# Altium schematic sheet HU_revB.SchDoc
size D; SheetNumber: 1; SheetTotal: 17
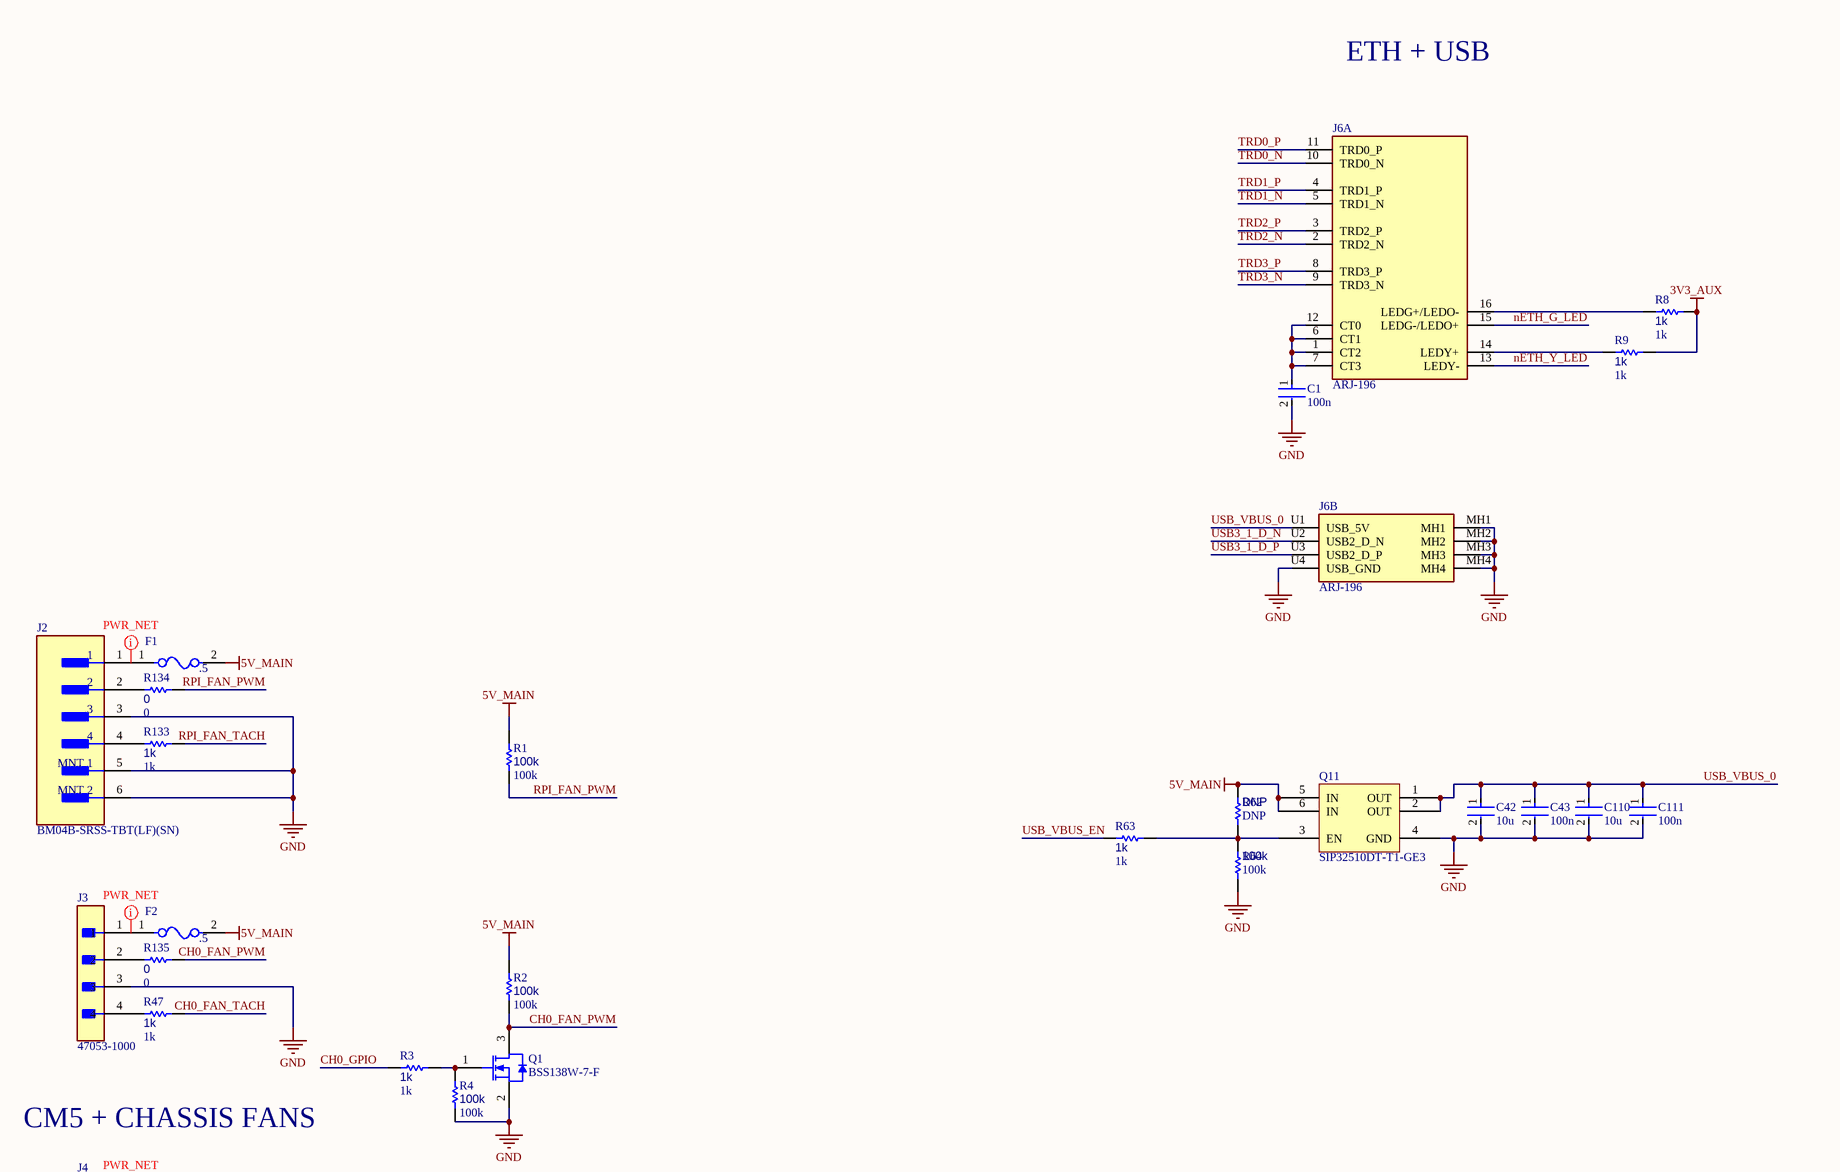
[diagram p0: HU_revB.SchDoc, top right]
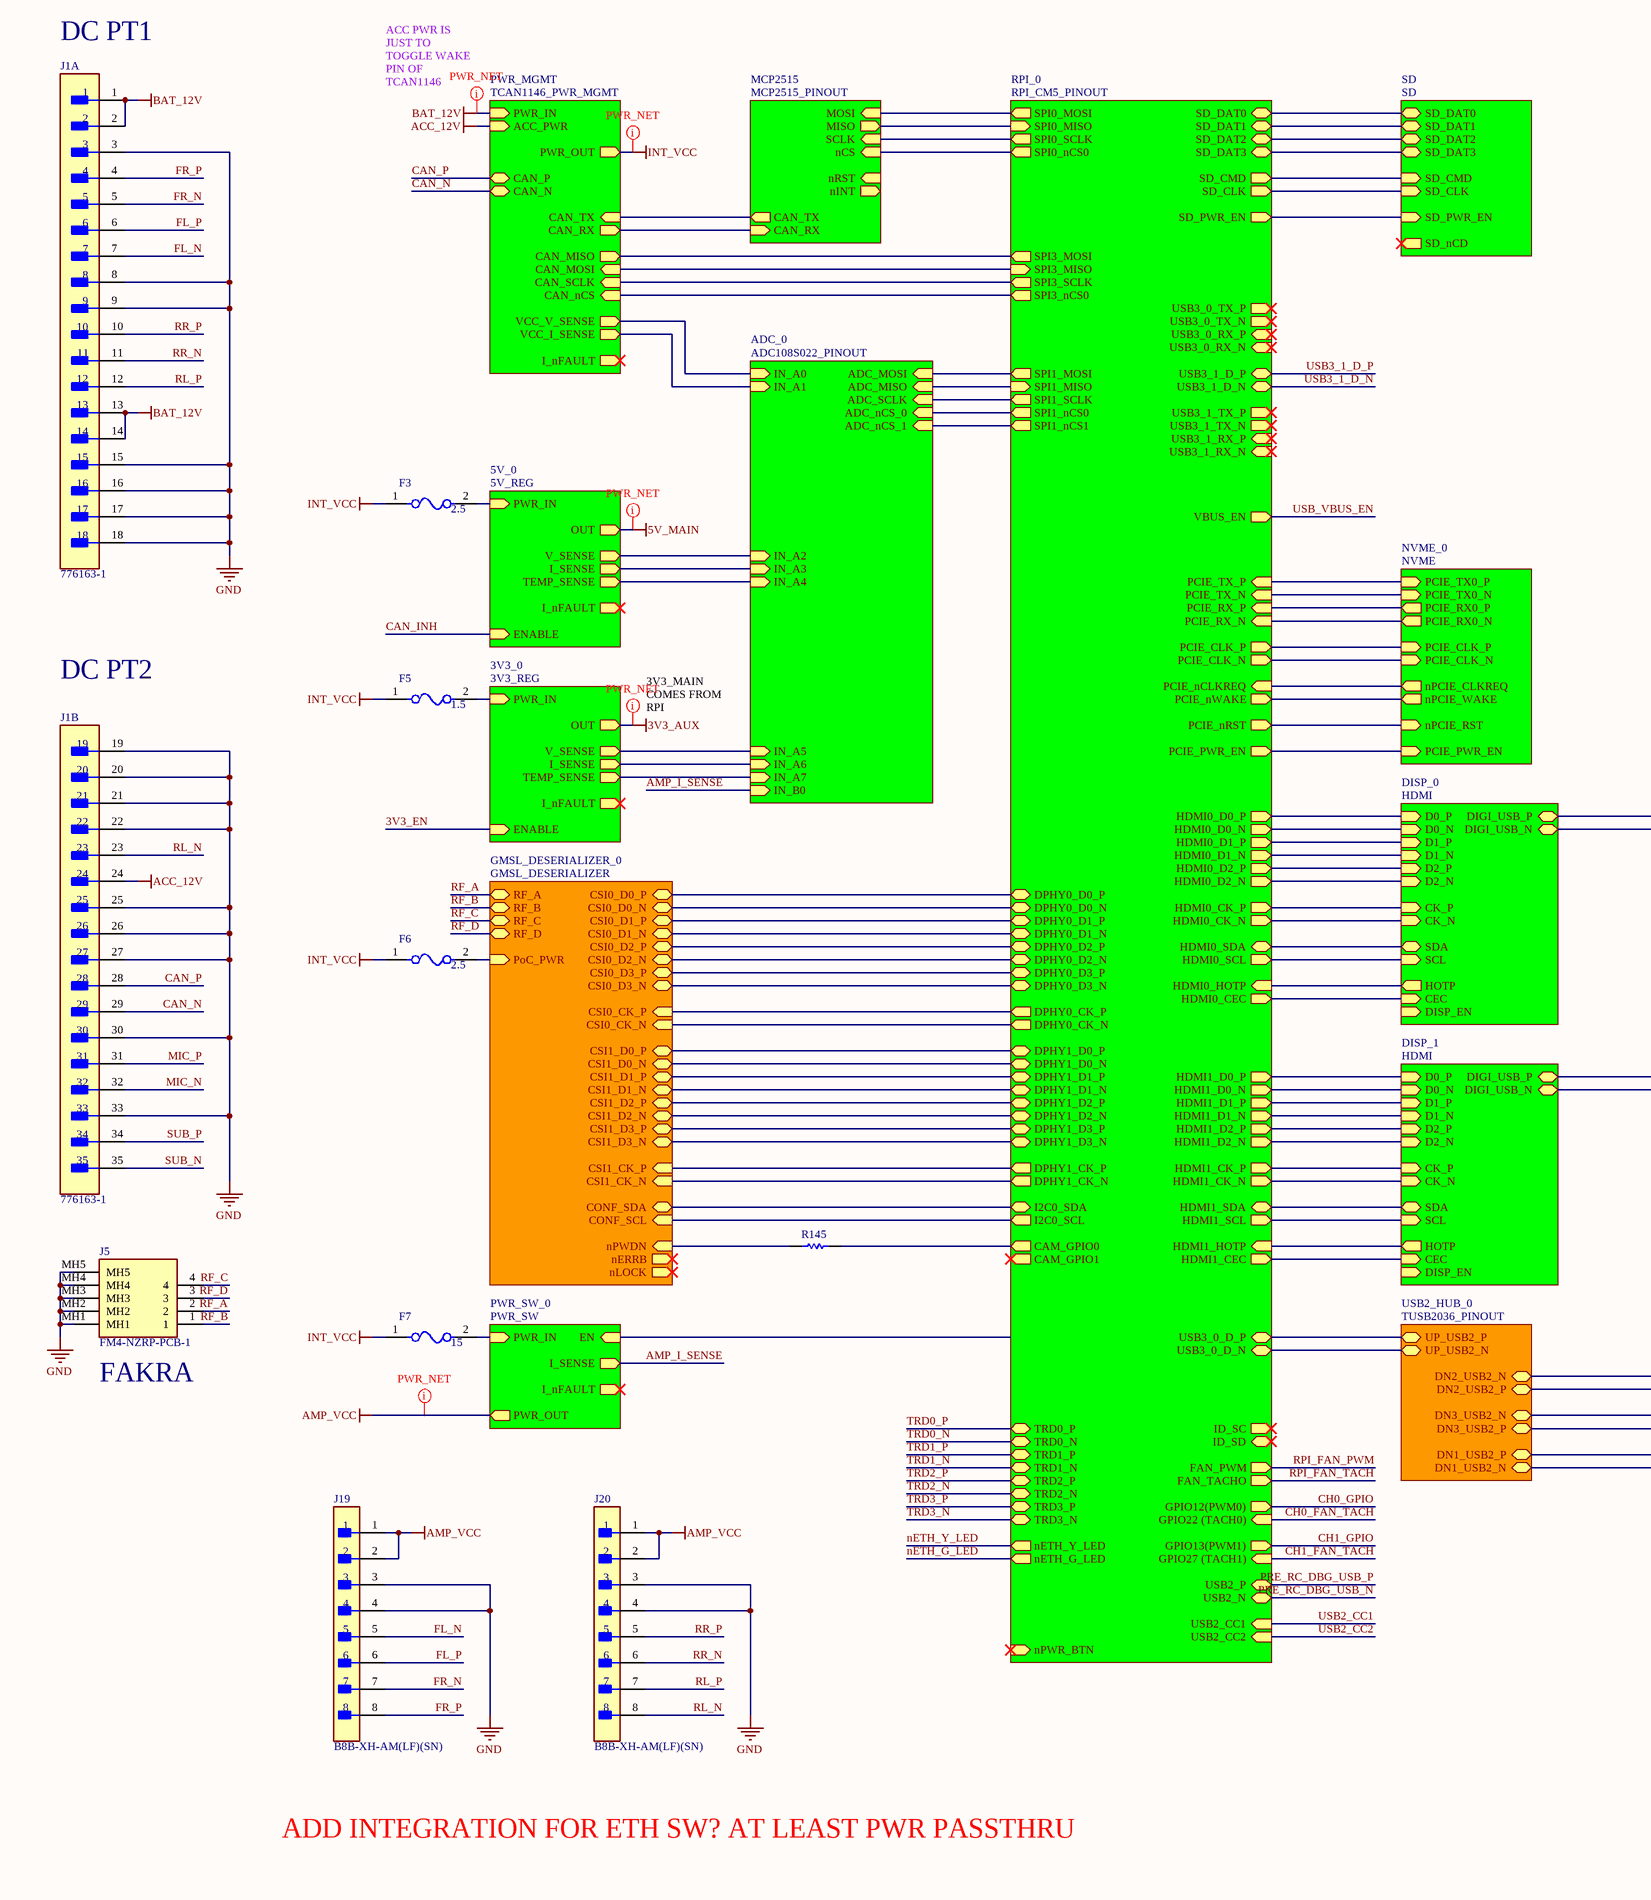
[diagram p1: HU_revB.SchDoc, bottom left]
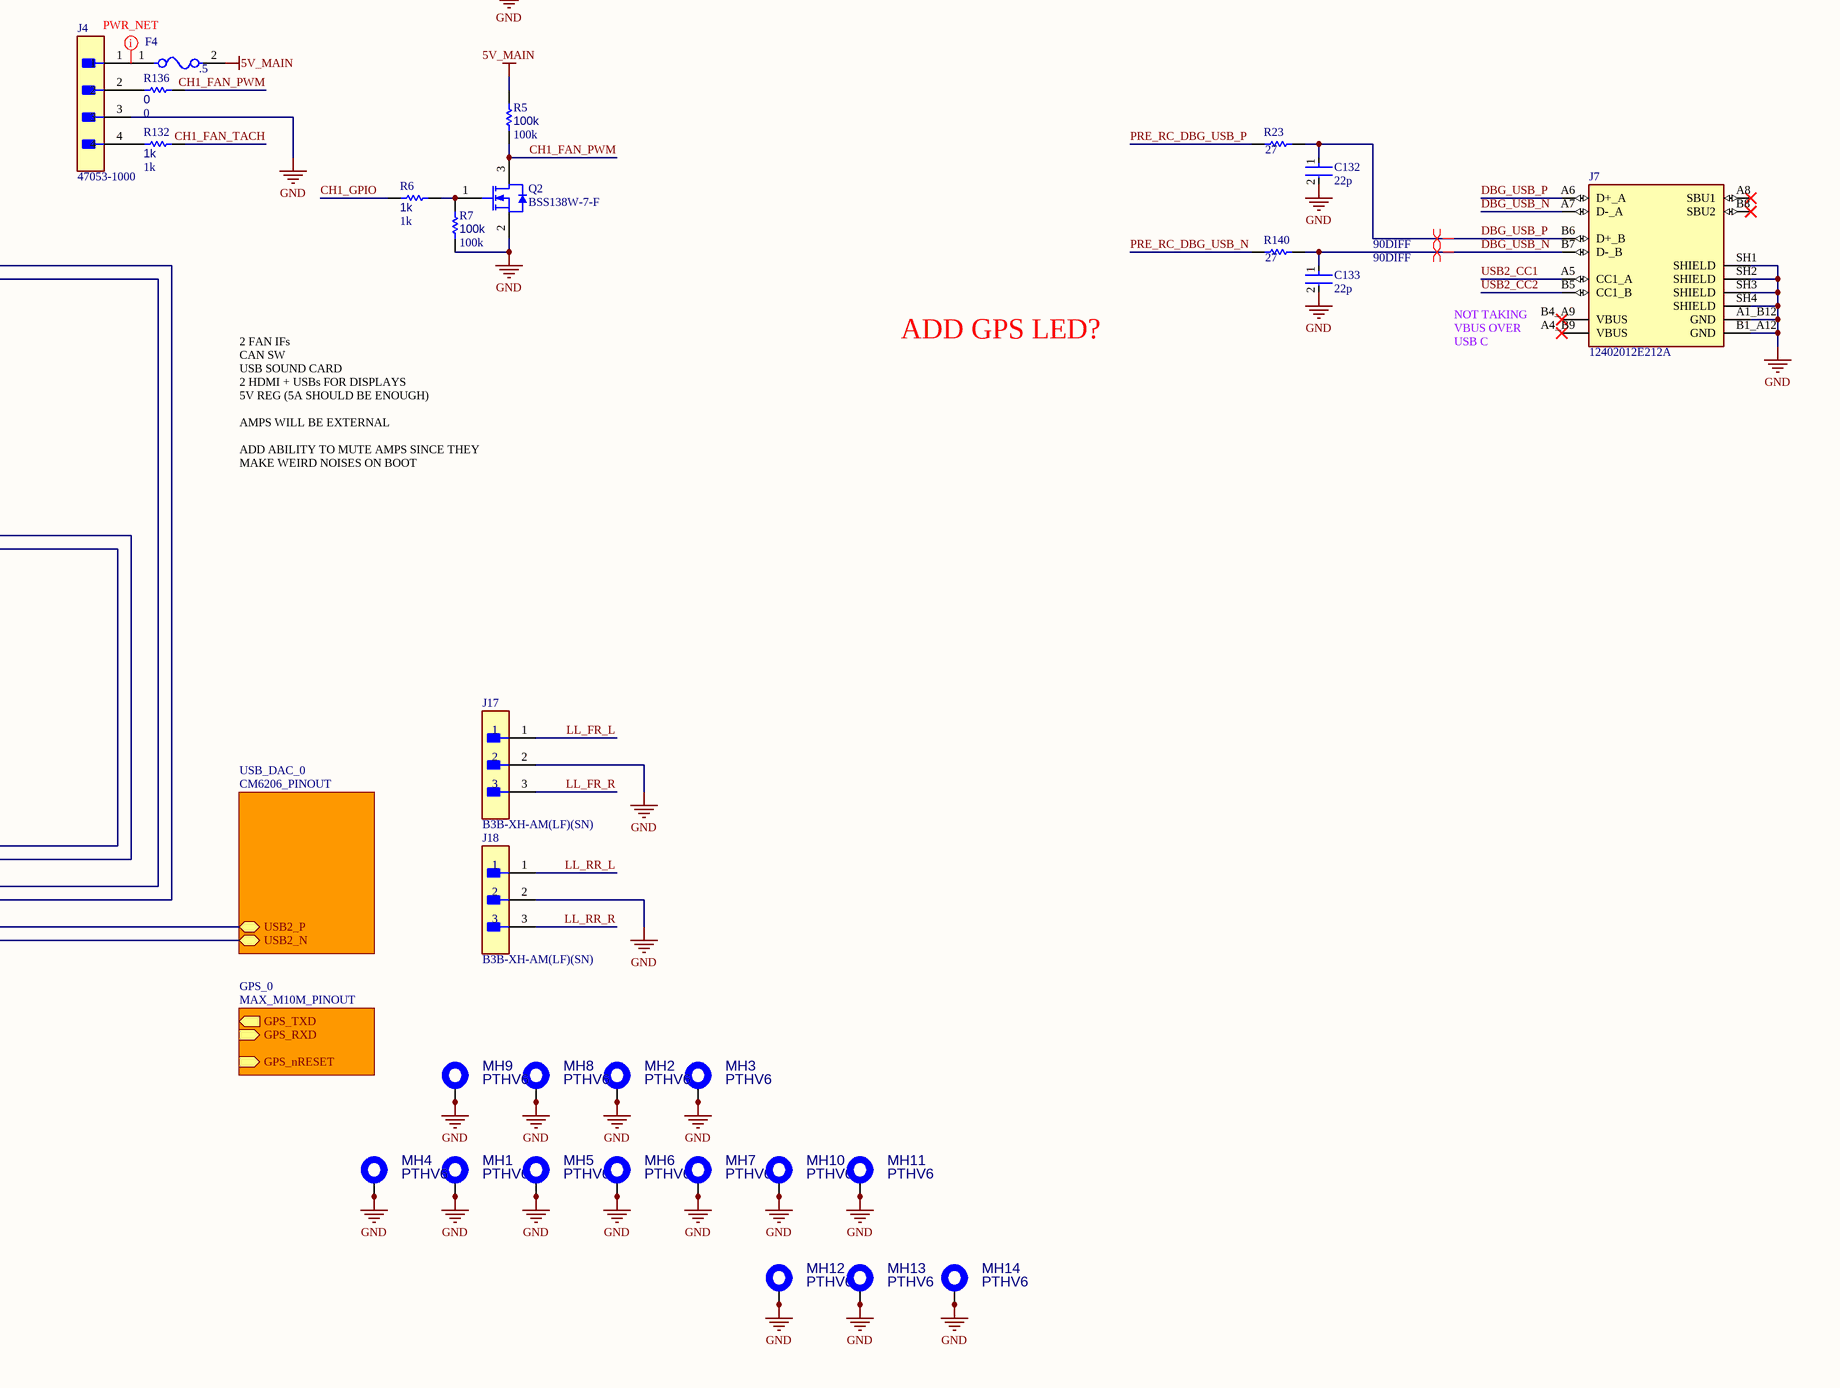
[diagram p2: HU_revB.SchDoc, bottom right]

## Parts
C1  100n  [FP-0402-L_1_0_0_05-W_0_5-IPC_A]
C42  10u  [FP-0402-L_1_0_0_05-W_0_5-IPC_A]
C43  100n  [FP-0402-L_1_0_0_05-W_0_5-IPC_A]
C110  10u  [FP-0402-L_1_0_0_05-W_0_5-IPC_A]
C111  100n  [FP-0402-L_1_0_0_05-W_0_5-IPC_A]
C132  22p  [FP-0402-L_1_0_0_05-W_0_5-IPC_A]
C133  22p  [FP-0402-L_1_0_0_05-W_0_5-IPC_A]
F1  .5  [FP-0685T-MFG]
F2  .5  [FP-0685T-MFG]
F3  2.5  [FP-0685T-MFG]
F4  .5  [FP-0685T-MFG]
F5  1.5  [FP-0685T-MFG]
F6  2.5  [FP-0685T-MFG]
F7  15  [FP-0685T-MFG]
J1  776163-1  [FP-776163-1-MFG]  (parts A,B of 2)
J2  BM04B-SRSS-TBT(LF)(SN)  [FP-BM04B-SRSS-TBT_LF_SN-MFG]
J3  47053-1000  [FP-470531000-MFG]
J4  47053-1000  [FP-470531000-MFG]
J5  FM4-NZRP-PCB-1  [FM4-NZRP-PCB-1-Footprint-1]
J6  ARJ-196  [ARJ-196-Footprint-1]  (parts A,B of 2)
J7  12402012E212A  [12402012E212A-Footprint-1]
J17  B3B-XH-AM(LF)(SN)  [FP-B3B-XH-AM_LF_SN-MFG]
J18  B3B-XH-AM(LF)(SN)  [FP-B3B-XH-AM_LF_SN-MFG]
J19  B8B-XH-AM(LF)(SN)  [FP-B8B-XH-AM_LF_SN-MFG]
J20  B8B-XH-AM(LF)(SN)  [FP-B8B-XH-AM_LF_SN-MFG]
MH1  PTHV6  [PTHV6 M2]  (net tie, no BOM)
MH2  PTHV6  [PTHV6 M2]  (net tie, no BOM)
MH3  PTHV6  [PTHV6 M2]  (net tie, no BOM)
MH4  PTHV6  [PTHV6 M2]  (net tie, no BOM)
MH5  PTHV6  [PTHV6 M2]  (net tie, no BOM)
MH6  PTHV6  [PTHV6 M2]  (net tie, no BOM)
MH7  PTHV6  [PTHV6 M2]  (net tie, no BOM)
MH8  PTHV6  [PTHV6 M2]  (net tie, no BOM)
MH9  PTHV6  [PTHV6 M2]  (net tie, no BOM)
MH10  PTHV6  [PTHV6 M2]  (net tie, no BOM)
MH11  PTHV6  [PTHV6 M2]  (net tie, no BOM)
MH12  PTHV6  [PTHV6 M2]  (net tie, no BOM)
MH13  PTHV6  [PTHV6 M2]  (net tie, no BOM)
MH14  PTHV6  [PTHV6 M2]  (net tie, no BOM)
Q1  BSS138W-7-F  [DIOD-SOT323-3_V]
Q2  BSS138W-7-F  [DIOD-SOT323-3_V]
Q11  SIP32510DT-T1-GE3  [SOT95P284X110-6N]
R1  100k  [R0603B]
R2  100k  [R0603B]
R3  1k  [R0603B]
R4  100k  [R0603B]
R5  100k  [R0603B]
R6  1k  [R0603B]
R7  100k  [R0603B]
R8  1k  [R0603B]
R9  1k  [R0603B]
R23  27  [R0603B]
R47  1k  [R0603B]
R62  DNP  [R0603B]
R63  1k  [R0603B]
R64  100k  [R0603B]
R132  1k  [R0603B]
R133  1k  [R0603B]
R134  0  [R0603B]
R135  0  [R0603B]
R136  0  [R0603B]
R140  27  [R0603B]
R145  DNP  [RESC1005X40X25ML05T05]  (value not drawn)

## Sub-sheets
3V3_0 = 3V3_REG: PWR_IN (in), OUT (out), V_SENSE (out), I_SENSE (out), TEMP_SENSE (out), I_nFAULT (out), ENABLE (in)
5V_0 = 5V_REG: PWR_IN (in), OUT (out), V_SENSE (out), I_SENSE (out), TEMP_SENSE (out), I_nFAULT (out), ENABLE (in)
ADC_0 = ADC108S022_PINOUT: IN_A0 (in), IN_A1 (in), IN_A2 (in), IN_A3 (in), IN_A4 (in), IN_A5 (in), IN_A6 (in), IN_A7 (in), IN_B0 (in), ADC_MOSI (in), ADC_MISO (in), ADC_SCLK (in), ADC_nCS_0 (in), ADC_nCS_1 (in)
DISP_0 = HDMI: D0_N (in), D0_P (in), D2_P (in), D2_N (in), D1_P (in), D1_N (in), CK_P (in), CK_N (in), CEC (in), HOTP (out), SCL (in), SDA (bidir), DISP_EN (in), DIGI_USB_P (bidir), DIGI_USB_N (bidir)
DISP_1 = HDMI: D0_N (in), D0_P (in), D2_P (in), D2_N (in), D1_P (in), D1_N (in), CK_P (in), CK_N (in), CEC (in), HOTP (out), SCL (in), SDA (bidir), DISP_EN (in), DIGI_USB_P (bidir), DIGI_USB_N (bidir)
GMSL_DESERIALIZER_0 = GMSL_DESERIALIZER: CSI0_D0_P (bidir), CSI0_D0_N (bidir), CSI0_D1_P (bidir), CSI0_D1_N (bidir), CSI0_D2_P (bidir), CSI0_D2_N (bidir), CSI0_D3_P (bidir), CSI0_D3_N (bidir), CSI0_CK_P (in), CSI0_CK_N (in), CSI1_D0_P (bidir), CSI1_D0_N (bidir), CSI1_D1_P (bidir), CSI1_D1_N (bidir), CSI1_D2_P (bidir), CSI1_D2_N (bidir), CSI1_D3_P (bidir), CSI1_D3_N (bidir), CSI1_CK_P (in), CSI1_CK_N (in), RF_B (bidir), RF_A (bidir), RF_C (bidir), RF_D (bidir), CONF_SDA (bidir), CONF_SCL (in), nPWDN (in), PoC_PWR (in), nERRB (out), nLOCK (out)
GPS_0 = MAX_M10M_PINOUT: GPS_TXD (out), GPS_RXD (in), GPS_nRESET (in)
MCP2515 = MCP2515_PINOUT: MOSI (in), nCS (in), SCLK (in), MISO (out), nINT (out), nRST (in), CAN_RX (in), CAN_TX (out)
NVME_0 = NVME: nPCIE_RST (in), nPCIE_CLKREQ (out), nPCIE_WAKE (out), PCIE_PWR_EN (in), PCIE_TX0_N (in), PCIE_TX0_P (in), PCIE_RX0_N (out), PCIE_RX0_P (out), PCIE_CLK_N (in), PCIE_CLK_P (in)
PWR_MGMT = TCAN1146_PWR_MGMT: PWR_IN (in), PWR_OUT (out), CAN_P (bidir), CAN_N (bidir), CAN_TX (in), CAN_RX (out), CAN_SCLK (in), CAN_MISO (out), CAN_MOSI (in), CAN_nCS (in), VCC_V_SENSE (out), VCC_I_SENSE (out), I_nFAULT (out), ACC_PWR (in)
PWR_SW_0 = PWR_SW: PWR_IN (in), PWR_OUT (out), EN (in), I_SENSE (out), I_nFAULT (out)
RPI_0 = RPI_CM5_PINOUT: SD_CLK (out), SD_CMD (out), SD_DAT3 (bidir), SD_DAT0 (bidir), SD_DAT1 (bidir), SD_DAT2 (bidir), SD_PWR_EN (out), USB3_0_D_P (bidir), USB3_0_D_N (bidir), USB3_1_D_P (bidir), USB3_1_D_N (bidir), USB3_0_RX_N (in), USB3_0_RX_P (in), USB3_0_TX_N (out), USB3_0_TX_P (out), USB3_1_RX_N (in), USB3_1_RX_P (in), USB3_1_TX_N (out), USB3_1_TX_P (out), VBUS_EN (out), PCIE_nCLKREQ (in), PCIE_nWAKE (out), PCIE_PWR_EN (out), PCIE_CLK_P (out), PCIE_nRST (out), PCIE_CLK_N (out), PCIE_RX_P (in), PCIE_RX_N (in), PCIE_TX_P (in), PCIE_TX_N (in), HDMI1_HOTP (in), HDMI1_SDA (bidir), HDMI1_D2_P (out), HDMI1_D2_N (out), HDMI1_SCL (out), HDMI1_CEC (out), HDMI0_CEC (out), HDMI1_D1_P (out), HDMI1_D1_N (out), HDMI0_HOTP (in), HDMI1_D0_P (out), HDMI1_D0_N (out), HDMI1_CK_P (out), HDMI1_CK_N (out), HDMI0_D2_P (out), HDMI0_D2_N (out), HDMI0_D1_P (out), HDMI0_D1_N (out), HDMI0_D0_P (out), HDMI0_D0_N (out), HDMI0_CK_P (out), HDMI0_CK_N (out), HDMI0_SCL (out), HDMI0_SDA (bidir), USB2_N (bidir), USB2_P (bidir), DPHY0_D0_N (bidir), DPHY0_D0_P (bidir), DPHY0_D1_N (bidir), DPHY0_D1_P (bidir), DPHY0_D2_N (bidir), DPHY0_D2_P (bidir), DPHY0_D3_N (bidir), DPHY0_D3_P (bidir), DPHY0_CK_N (out), DPHY0_CK_P (out), DPHY1_D0_N (bidir), DPHY1_D0_P (bidir), DPHY1_D1_N (bidir), DPHY1_D1_P (bidir), DPHY1_D3_N (bidir), DPHY1_D2_N (bidir), DPHY1_D3_P (bidir), DPHY1_D2_P (bidir), DPHY1_CK_N (out), DPHY1_CK_P (out), TRD3_P (bidir), TRD1_P (bidir), TRD3_N (bidir), TRD1_N (bidir), TRD2_N (bidir), TRD0_N (bidir), TRD2_P (bidir), TRD0_P (bidir), nETH_Y_LED (out), nETH_G_LED (out), FAN_TACHO (out), FAN_PWM (out), SPI0_SCLK (out), SPI0_MISO (in), SPI0_nCS0 (out), SPI0_MOSI (out), SPI3_MOSI (out), SPI3_MISO (in), SPI3_SCLK (out), SPI3_nCS0 (out), SPI1_MISO (in), SPI1_MOSI (out), SPI1_nCS0 (out), SPI1_nCS1 (out), SPI1_SCLK (out), I2C0_SCL (out), I2C0_SDA (bidir), CAM_GPIO0 (out), CAM_GPIO1 (out), nPWR_BTN (in), GPIO12(PWM0) (out), GPIO13(PWM1) (out), GPIO22 (TACH0) (in), GPIO27 (TACH1) (in), ID_SC (out), ID_SD (bidir), USB2_CC1 (in), USB2_CC2 (in)
SD = SD: SD_DAT0 (bidir), SD_DAT1 (bidir), SD_DAT2 (bidir), SD_DAT3 (bidir), SD_CMD (in), SD_CLK (in), SD_PWR_EN (in), SD_nCD (out)
USB2_HUB_0 = TUSB2036_PINOUT: UP_USB2_N (bidir), UP_USB2_P (bidir), DN1_USB2_N (bidir), DN1_USB2_P (bidir), DN2_USB2_N (bidir), DN2_USB2_P (bidir), DN3_USB2_N (bidir), DN3_USB2_P (bidir)
USB_DAC_0 = CM6206_PINOUT: USB2_P (bidir), USB2_N (bidir)

## Nets
3V3_AUX: R8.1 R9.1 ; sheet 3V3_0/OUT
5V_MAIN: F1.2 F2.2 F4.2 Q11.5(IN) Q11.6(IN) R1.1 R2.1 R5.1 R62.2 ; sheet 5V_0/OUT
ACC_12V: J1.24 ; sheet PWR_MGMT/ACC_PWR
AMP_VCC: J19.1 J19.2 J20.1 J20.2 ; sheet PWR_SW_0/PWR_OUT
BAT_12V: J1.1 J1.2 J1.13 J1.14 ; sheet PWR_MGMT/PWR_IN
GND: C1.2 C42.2 C43.2 C110.2 C111.2 C132.2 C133.2 J1.3 J1.8 J1.9 J1.15 J1.16 J1.17 J1.18 J1.19 J1.20 J1.21 J1.22 J1.25 J1.26 J1.27 J1.30 J1.33 J2.3 J2.5(MNT_1) J2.6(MNT_2) J3.3 J4.3 J5.MH1 J5.MH2 J5.MH3 J5.MH4 J5.MH5 J6.MH1 J6.MH2 J6.MH3 J6.MH4 J6.U4(USB_GND) J7.A1_B12(GND) J7.B1_A12(GND) J7.SH1(SHIELD) J7.SH2(SHIELD) J7.SH3(SHIELD) J7.SH4(SHIELD) J17.2 J18.2 J19.3 J19.4 J20.3 J20.4 MH1.1(MH) MH1.2(V1) MH1.3(V2) MH1.4(V3) MH1.5(V4) MH1.6(V5) MH1.7(V6) MH2.1(MH) MH2.2(V1) MH2.3(V2) MH2.4(V3) MH2.5(V4) MH2.6(V5) MH2.7(V6) MH3.1(MH) MH3.2(V1) MH3.3(V2) MH3.4(V3) MH3.5(V4) MH3.6(V5) MH3.7(V6) MH4.1(MH) MH4.2(V1) MH4.3(V2) MH4.4(V3) MH4.5(V4) MH4.6(V5) MH4.7(V6) MH5.1(MH) MH5.2(V1) MH5.3(V2) MH5.4(V3) MH5.5(V4) MH5.6(V5) MH5.7(V6) MH6.1(MH) MH6.2(V1) MH6.3(V2) MH6.4(V3) MH6.5(V4) MH6.6(V5) MH6.7(V6) MH7.1(MH) MH7.2(V1) MH7.3(V2) MH7.4(V3) MH7.5(V4) MH7.6(V5) MH7.7(V6) MH8.1(MH) MH8.2(V1) MH8.3(V2) MH8.4(V3) MH8.5(V4) MH8.6(V5) MH8.7(V6) MH9.1(MH) MH9.2(V1) MH9.3(V2) MH9.4(V3) MH9.5(V4) MH9.6(V5) MH9.7(V6) MH10.1(MH) MH10.2(V1) MH10.3(V2) MH10.4(V3) MH10.5(V4) MH10.6(V5) MH10.7(V6) MH11.1(MH) MH11.2(V1) MH11.3(V2) MH11.4(V3) MH11.5(V4) MH11.6(V5) MH11.7(V6) MH12.1(MH) MH12.2(V1) MH12.3(V2) MH12.4(V3) MH12.5(V4) MH12.6(V5) MH12.7(V6) MH13.1(MH) MH13.2(V1) MH13.3(V2) MH13.4(V3) MH13.5(V4) MH13.6(V5) MH13.7(V6) MH14.1(MH) MH14.2(V1) MH14.3(V2) MH14.4(V3) MH14.5(V4) MH14.6(V5) MH14.7(V6) Q1.2(S) Q2.2(S) Q11.4(GND) R4.2 R7.2 R64.1
INT_VCC: F3.1 F5.1 F6.1 F7.1 ; sheet PWR_MGMT/PWR_OUT
3V3_EN: sheet 3V3_0/ENABLE
AMP_I_SENSE: sheet ADC_0/IN_B0, sheet PWR_SW_0/I_SENSE
CAN_INH: sheet 5V_0/ENABLE
CAN_N: J1.29 ; sheet PWR_MGMT/CAN_N
CAN_P: J1.28 ; sheet PWR_MGMT/CAN_P
CH0_FAN_PWM: Q1.3(D) R2.2 R135.2
CH0_FAN_TACH: R47.2 ; sheet RPI_0/GPIO22 (TACH0)
CH0_GPIO: R3.1 ; sheet RPI_0/GPIO12(PWM0)
CH1_FAN_PWM: Q2.3(D) R5.2 R136.2
CH1_FAN_TACH: R132.2 ; sheet RPI_0/GPIO27 (TACH1)
CH1_GPIO: R6.1 ; sheet RPI_0/GPIO13(PWM1)
DBG_USB_N: C133.1 J7.A7(D-_A) J7.B7(D-_B) R140.1
DBG_USB_P: C132.1 J7.A6(D+_A) J7.B6(D+_B) R23.1
FL_N: J1.7 J19.5
FL_P: J1.6 J19.6
FR_N: J1.5 J19.7
FR_P: J1.4 J19.8
LL_FR_L: J17.1
LL_FR_R: J17.3
LL_RR_L: J18.1
LL_RR_R: J18.3
MIC_N: J1.32
MIC_P: J1.31
nETH_G_LED: J6.15(LEDG-/LEDO+) ; sheet RPI_0/nETH_G_LED
nETH_Y_LED: J6.13(LEDY-) ; sheet RPI_0/nETH_Y_LED
PRE_RC_DBG_USB_N: R140.2 ; sheet RPI_0/USB2_N
PRE_RC_DBG_USB_P: R23.2 ; sheet RPI_0/USB2_P
RF_A: J5.2 ; sheet GMSL_DESERIALIZER_0/RF_A
RF_B: J5.1 ; sheet GMSL_DESERIALIZER_0/RF_B
RF_C: J5.4 ; sheet GMSL_DESERIALIZER_0/RF_C
RF_D: J5.3 ; sheet GMSL_DESERIALIZER_0/RF_D
RL_N: J1.23 J20.8
RL_P: J1.12 J20.7
RPI_FAN_PWM: R1.2 R134.2 ; sheet RPI_0/FAN_PWM
RPI_FAN_TACH: R133.2 ; sheet RPI_0/FAN_TACHO
RR_N: J1.11 J20.6
RR_P: J1.10 J20.5
SUB_N: J1.35
SUB_P: J1.34
TRD0_N: J6.10(TRD0_N) ; sheet RPI_0/TRD0_N
TRD0_P: J6.11(TRD0_P) ; sheet RPI_0/TRD0_P
TRD1_N: J6.5(TRD1_N) ; sheet RPI_0/TRD1_N
TRD1_P: J6.4(TRD1_P) ; sheet RPI_0/TRD1_P
TRD2_N: J6.2(TRD2_N) ; sheet RPI_0/TRD2_N
TRD2_P: J6.3(TRD2_P) ; sheet RPI_0/TRD2_P
TRD3_N: J6.9(TRD3_N) ; sheet RPI_0/TRD3_N
TRD3_P: J6.8(TRD3_P) ; sheet RPI_0/TRD3_P
USB2_CC1: J7.A5(CC1_A) ; sheet RPI_0/USB2_CC1
USB2_CC2: J7.B5(CC1_B) ; sheet RPI_0/USB2_CC2
USB3_1_D_N: J6.U2(USB2_D_N) ; sheet RPI_0/USB3_1_D_N
USB3_1_D_P: J6.U3(USB2_D_P) ; sheet RPI_0/USB3_1_D_P
USB_VBUS_0: C42.1 C43.1 C110.1 C111.1 J6.U1(USB_5V) Q11.1(OUT) Q11.2(OUT)
USB_VBUS_EN: R63.2 ; sheet RPI_0/VBUS_EN
NetC1_1: C1.1 J6.1(CT2) J6.6(CT1) J6.7(CT3) J6.12(CT0)
NetF1_1: F1.1 J2.1
NetF2_1: F2.1 J3.1
NetF3_2: F3.2 ; sheet 5V_0/PWR_IN
NetF4_1: F4.1 J4.1
NetF5_2: F5.2 ; sheet 3V3_0/PWR_IN
NetF6_2: F6.2 ; sheet GMSL_DESERIALIZER_0/PoC_PWR
NetF7_2: F7.2 ; sheet PWR_SW_0/PWR_IN
NetJ2_2: J2.2 R134.1
NetJ2_4: J2.4 R133.1
NetJ3_2: J3.2 R135.1
NetJ3_4: J3.4 R47.1
NetJ4_2: J4.2 R136.1
NetJ4_4: J4.4 R132.1
NetJ6_14: J6.14(LEDY+) R9.2
NetJ6_16: J6.16(LEDG+/LEDO-) R8.2
NetQ1_1: Q1.1(G) R3.2 R4.1
NetQ2_1: Q2.1(G) R6.2 R7.1
NetQ11_3: Q11.3(EN) R62.1 R63.1 R64.2
NetR145_1: R145.1 ; sheet RPI_0/CAM_GPIO0
NetR145_2: R145.2 ; sheet GMSL_DESERIALIZER_0/nPWDN
(unnamed): sheet PWR_MGMT/CAN_TX, sheet MCP2515/CAN_TX
(unnamed): sheet PWR_MGMT/CAN_RX, sheet MCP2515/CAN_RX
(unnamed): sheet PWR_MGMT/CAN_SCLK, sheet RPI_0/SPI3_SCLK
(unnamed): sheet PWR_MGMT/CAN_MISO, sheet RPI_0/SPI3_MOSI
(unnamed): sheet PWR_MGMT/CAN_MOSI, sheet RPI_0/SPI3_MISO
(unnamed): sheet PWR_MGMT/CAN_nCS, sheet RPI_0/SPI3_nCS0
(unnamed): sheet PWR_MGMT/VCC_V_SENSE, sheet ADC_0/IN_A0
(unnamed): sheet PWR_MGMT/VCC_I_SENSE, sheet ADC_0/IN_A1
(unnamed): sheet USB_DAC_0/USB2_P, sheet USB2_HUB_0/DN1_USB2_P
(unnamed): sheet USB_DAC_0/USB2_N, sheet USB2_HUB_0/DN1_USB2_N
(unnamed): sheet RPI_0/SD_CLK, sheet SD/SD_CLK
(unnamed): sheet RPI_0/SD_CMD, sheet SD/SD_CMD
(unnamed): sheet RPI_0/SD_DAT3, sheet SD/SD_DAT3
(unnamed): sheet RPI_0/SD_DAT0, sheet SD/SD_DAT0
(unnamed): sheet RPI_0/SD_DAT1, sheet SD/SD_DAT1
(unnamed): sheet RPI_0/SD_DAT2, sheet SD/SD_DAT2
(unnamed): sheet RPI_0/SD_PWR_EN, sheet SD/SD_PWR_EN
(unnamed): sheet RPI_0/USB3_0_D_P, sheet USB2_HUB_0/UP_USB2_P
(unnamed): sheet RPI_0/USB3_0_D_N, sheet USB2_HUB_0/UP_USB2_N
(unnamed): sheet RPI_0/PCIE_nCLKREQ, sheet NVME_0/nPCIE_CLKREQ
(unnamed): sheet RPI_0/PCIE_nWAKE, sheet NVME_0/nPCIE_WAKE
(unnamed): sheet RPI_0/PCIE_PWR_EN, sheet NVME_0/PCIE_PWR_EN
(unnamed): sheet RPI_0/PCIE_CLK_P, sheet NVME_0/PCIE_CLK_P
(unnamed): sheet RPI_0/PCIE_nRST, sheet NVME_0/nPCIE_RST
(unnamed): sheet RPI_0/PCIE_CLK_N, sheet NVME_0/PCIE_CLK_N
(unnamed): sheet RPI_0/PCIE_RX_P, sheet NVME_0/PCIE_RX0_P
(unnamed): sheet RPI_0/PCIE_RX_N, sheet NVME_0/PCIE_RX0_N
(unnamed): sheet RPI_0/PCIE_TX_P, sheet NVME_0/PCIE_TX0_P
(unnamed): sheet RPI_0/PCIE_TX_N, sheet NVME_0/PCIE_TX0_N
(unnamed): sheet RPI_0/HDMI1_HOTP, sheet DISP_1/HOTP
(unnamed): sheet RPI_0/HDMI1_SDA, sheet DISP_1/SDA
(unnamed): sheet RPI_0/HDMI1_D2_P, sheet DISP_1/D2_P
(unnamed): sheet RPI_0/HDMI1_D2_N, sheet DISP_1/D2_N
(unnamed): sheet RPI_0/HDMI1_SCL, sheet DISP_1/SCL
(unnamed): sheet RPI_0/HDMI1_CEC, sheet DISP_1/CEC
(unnamed): sheet RPI_0/HDMI0_CEC, sheet DISP_0/CEC
(unnamed): sheet RPI_0/HDMI1_D1_P, sheet DISP_1/D1_P
(unnamed): sheet RPI_0/HDMI1_D1_N, sheet DISP_1/D1_N
(unnamed): sheet RPI_0/HDMI0_HOTP, sheet DISP_0/HOTP
(unnamed): sheet RPI_0/HDMI1_D0_P, sheet DISP_1/D0_P
(unnamed): sheet RPI_0/HDMI1_D0_N, sheet DISP_1/D0_N
(unnamed): sheet RPI_0/HDMI1_CK_P, sheet DISP_1/CK_P
(unnamed): sheet RPI_0/HDMI1_CK_N, sheet DISP_1/CK_N
(unnamed): sheet RPI_0/HDMI0_D2_P, sheet DISP_0/D2_P
(unnamed): sheet RPI_0/HDMI0_D2_N, sheet DISP_0/D2_N
(unnamed): sheet RPI_0/HDMI0_D1_P, sheet DISP_0/D1_P
(unnamed): sheet RPI_0/HDMI0_D1_N, sheet DISP_0/D1_N
(unnamed): sheet RPI_0/HDMI0_D0_P, sheet DISP_0/D0_P
(unnamed): sheet RPI_0/HDMI0_D0_N, sheet DISP_0/D0_N
(unnamed): sheet RPI_0/HDMI0_CK_P, sheet DISP_0/CK_P
(unnamed): sheet RPI_0/HDMI0_CK_N, sheet DISP_0/CK_N
(unnamed): sheet RPI_0/HDMI0_SCL, sheet DISP_0/SCL
(unnamed): sheet RPI_0/HDMI0_SDA, sheet DISP_0/SDA
(unnamed): sheet RPI_0/DPHY0_D0_N, sheet GMSL_DESERIALIZER_0/CSI0_D0_N
(unnamed): sheet RPI_0/DPHY0_D0_P, sheet GMSL_DESERIALIZER_0/CSI0_D0_P
(unnamed): sheet RPI_0/DPHY0_D1_N, sheet GMSL_DESERIALIZER_0/CSI0_D1_N
(unnamed): sheet RPI_0/DPHY0_D1_P, sheet GMSL_DESERIALIZER_0/CSI0_D1_P
(unnamed): sheet RPI_0/DPHY0_D2_N, sheet GMSL_DESERIALIZER_0/CSI0_D2_N
(unnamed): sheet RPI_0/DPHY0_D2_P, sheet GMSL_DESERIALIZER_0/CSI0_D2_P
(unnamed): sheet RPI_0/DPHY0_D3_N, sheet GMSL_DESERIALIZER_0/CSI0_D3_N
(unnamed): sheet RPI_0/DPHY0_D3_P, sheet GMSL_DESERIALIZER_0/CSI0_D3_P
(unnamed): sheet RPI_0/DPHY0_CK_N, sheet GMSL_DESERIALIZER_0/CSI0_CK_N
(unnamed): sheet RPI_0/DPHY0_CK_P, sheet GMSL_DESERIALIZER_0/CSI0_CK_P
(unnamed): sheet RPI_0/DPHY1_D0_N, sheet GMSL_DESERIALIZER_0/CSI1_D0_N
(unnamed): sheet RPI_0/DPHY1_D0_P, sheet GMSL_DESERIALIZER_0/CSI1_D0_P
(unnamed): sheet RPI_0/DPHY1_D1_N, sheet GMSL_DESERIALIZER_0/CSI1_D1_N
(unnamed): sheet RPI_0/DPHY1_D1_P, sheet GMSL_DESERIALIZER_0/CSI1_D1_P
(unnamed): sheet RPI_0/DPHY1_D3_N, sheet GMSL_DESERIALIZER_0/CSI1_D3_N
(unnamed): sheet RPI_0/DPHY1_D2_N, sheet GMSL_DESERIALIZER_0/CSI1_D2_N
(unnamed): sheet RPI_0/DPHY1_D3_P, sheet GMSL_DESERIALIZER_0/CSI1_D3_P
(unnamed): sheet RPI_0/DPHY1_D2_P, sheet GMSL_DESERIALIZER_0/CSI1_D2_P
(unnamed): sheet RPI_0/DPHY1_CK_N, sheet GMSL_DESERIALIZER_0/CSI1_CK_N
(unnamed): sheet RPI_0/DPHY1_CK_P, sheet GMSL_DESERIALIZER_0/CSI1_CK_P
(unnamed): sheet RPI_0/SPI0_SCLK, sheet MCP2515/SCLK
(unnamed): sheet RPI_0/SPI0_MISO, sheet MCP2515/MISO
(unnamed): sheet RPI_0/SPI0_nCS0, sheet MCP2515/nCS
(unnamed): sheet RPI_0/SPI0_MOSI, sheet MCP2515/MOSI
(unnamed): sheet RPI_0/SPI1_MISO, sheet ADC_0/ADC_MISO
(unnamed): sheet RPI_0/SPI1_MOSI, sheet ADC_0/ADC_MOSI
(unnamed): sheet RPI_0/SPI1_nCS0, sheet ADC_0/ADC_nCS_0
(unnamed): sheet RPI_0/SPI1_nCS1, sheet ADC_0/ADC_nCS_1
(unnamed): sheet RPI_0/SPI1_SCLK, sheet ADC_0/ADC_SCLK
(unnamed): sheet RPI_0/I2C0_SCL, sheet GMSL_DESERIALIZER_0/CONF_SCL
(unnamed): sheet RPI_0/I2C0_SDA, sheet GMSL_DESERIALIZER_0/CONF_SDA
(unnamed): sheet 5V_0/V_SENSE, sheet ADC_0/IN_A2
(unnamed): sheet 5V_0/I_SENSE, sheet ADC_0/IN_A3
(unnamed): sheet 5V_0/TEMP_SENSE, sheet ADC_0/IN_A4
(unnamed): sheet ADC_0/IN_A5, sheet 3V3_0/V_SENSE
(unnamed): sheet ADC_0/IN_A6, sheet 3V3_0/I_SENSE
(unnamed): sheet ADC_0/IN_A7, sheet 3V3_0/TEMP_SENSE
(unnamed): sheet DISP_0/DIGI_USB_P, sheet USB2_HUB_0/DN3_USB2_P
(unnamed): sheet DISP_0/DIGI_USB_N, sheet USB2_HUB_0/DN3_USB2_N
(unnamed): sheet USB2_HUB_0/DN2_USB2_N, sheet DISP_1/DIGI_USB_N
(unnamed): sheet USB2_HUB_0/DN2_USB2_P, sheet DISP_1/DIGI_USB_P

Not connected (* = marked no-connect by the designer): J7 A4_B9(VBUS)* A8(SBU1)* B4_A9(VBUS)* B8(SBU2)*

## Layout directives
net class PWR: 3V3_AUX, 5V_MAIN, AMP_VCC, BAT_12V, INT_VCC, NetF1_1, NetF2_1, NetF4_1
differential pair; differential pair class 90DIFF: DBG_USB_N, DBG_USB_P

## Notes on the sheet
- ETH + USB
- DC PT1
- ACC PWR IS JUST TO TOGGLE WAKE PIN OF TCAN1146
- CM5 + CHASSIS FANS
- DC PT2
- 3V3_MAIN COMES FROM RPI
- ADD GPS LED?
- NOT TAKING VBUS OVER USB C
- 2 FAN IFs
  CAN SW
  USB SOUND CARD
  2 HDMI + USBs FOR DISPLAYS
  5V REG (5A SHOULD BE ENOUGH)
  AMPS WILL BE EXTERNAL
  ADD ABILITY TO MUTE AMPS SINCE THEY MAKE WEIRD NOISES ON BOOT
- (near J5) FAKRA
- ADD INTEGRATION FOR ETH SW? AT LEAST PWR PASSTHRU

## Library data of the parts
C1 C42 C43 C110 C111 C132 C133 = CMP-001-00058-1: LARGE PADS, 0402 CAP, CHANGE COMMENT TO MATCH REAL P/N; Capacitor Type: Ceramic; Min Operating Temperature: -55°C; Mounting Technology: Surface Mount; Pins: 2; Case/Package: 0402; RoHS Compliant: Yes; Max Operating Temperature: 85°C
F1-F7 = CMP-16042-000006-1: FUSE BOARD MNT 5A 63VAC/VDC 1206; RoHS Compliant: Yes
J1 = CMP-03369-000154-1: CONN HEADER R/A 35POS 4MM; Primary Type: Rectangular; Circuit Application: Power; Tab Thickness: 1.3mm; Number of Signal Positions: 35; Shielding: Unshielded; Pitch: 0.157inch; Max Voltage Rating (AC): 250V; Connector System: Wire-to-Device; Insulation: Insulated; Current Rating: 17A; PCB Thickness: 0.062inch; PCB Mount Retention: With; Gender: Male; Connector Type: Male Pin; PCB Mount Alignment: Yes (With); Series: Ampseal; Depth: 37.9mm; Orientation: Right Angle; Length: 3.03inch; Termination: Solder; Radiation Hardening: No; Number of Rows: 3; Contact Plating: Tin; Lead Free: Lead Free; Flammability Rating: UL94 V-0; Contact Material: Brass; Number of Contacts: 35; ELV: Compliant; Max Operating Temperature: 221°C; Min Operating Temperature: -40°C; Package Quantity: 1; Mount: Through Hole; Contact Type: Male Pin; Housing Material: Thermoplastic; Number of Positions: 35; Packaging: Bulk; Row Spacing: 0.157inch; RoHS Compliant: Yes; Height: 32.1mm; Color: Black; Fastening Type: Ramp; Sealable: Yes (With); Width: 37.9mm
J2 = CMP-17439-000370-1: CONN HEADER SMD 4POS 1MM; Voltage Rating: 50V; Number of Positions: 4; Pitch: 0.039inch; Mated Stacking Heights: 4.9mm; Packaging: Cut Tape; Contact Material: Copper Alloy; Lead Free: Lead Free; Contact Type: Male Pin; Fastening Type: Pull; Connector Type: Header; Contact Finish - Mating: TIN; Series: SR; Number of Rows: 1; Contact Shape: Square; Package Quantity: 1; Color: Natural; Flammability Rating: UL94 V-0; Mount: Surface Mount; Insulation Color: Natural; Termination: Solder; Contact Plating: Tin; Insulation Material: Nylon
J3 J4 = CMP-04776-000290-2: CONN HEADER VERT 4POS 2.54MM; NexarPartId: 854935; Manufacturer Lifecycle Status: ACTIVE; Voltage Rating (DC): 250V; Gender: Male; Plating: Copper; Number of Positions: 4; Glow Wire Compliant: Non-compliant; Current Rating: 500mA; Max Operating Temperature: 75°C; Number of Rows: 1; REACH SVHC: Unknown; Ambient Temperature Range High: 105°C; Pitch: 2.54mm; Height: 7.7mm; Min Operating Temperature: 0°C; Packaging: Bulk; Contact Material: Brass, Copper; Contact Plating: Tin; Lead Pitch: 2.54mm; Voltage Rating: 250V; Termination: Through Hole; Radiation Hardening: No; Orientation: Vertical; Mount: Through Hole; Number of Pins: 4; Country of Origin: HK; Halogen Free: Low Halogen; Lifecycle Status: Production; Number of Circuits: 4; Schedule B: 8536694040, 8536694040; Housing Color: Beige; Housing Material: Nylon; Depth: 5.84mm; RoHS: Compliant; Length: 10.2mm; Number of Contacts: 4
J5 = CMP-002-00044-4: Connector RF Mini-FAKRA Plug 9GHz 50Ohm Solder Right Angle Through Hole; Source: fakra4ch.SchLib; Component Type: Standard; Pins: 9; Design Item ID: CMP-002-00085-1
J6 = CMP-002-00092-1: Modular Connectors / Ethernet Connectors CONN MAGJACK 1PORT 1000 BASE-T; Connector Type: RJ45, USB; Max Operating Temperature: 85°C; Mounting Technology: Through Hole; Min Operating Temperature: -40°C
J7 = CMP-002-00091-1: USB Connector, USB Type C, USB 2.0, Receptacle, 24 Ways, Surface Mount, Through Hole Mount; Pins: 24
J17 J18 = CMP-17438-000009-1: CONN HEADER VERT 3POS 2.5MM; Max Current Rating: 3A; Gender: Male; Max Voltage Rating (AC): 250V; Connector Type: Male Pin; Pitch: 0.098inch; Number of Positions: 3; Contact Resistance: 20mR; Termination: Press-Fit; Housing Color: White; Housing Material: Polyamide; Orientation: Straight; Contact Material: Brass; Contact Type: Male Pin; Color: Natural; Packaging: Bulk; Lead Free: Lead Free; Depth: 5.75mm; Number of Rows: 1; Contact Plating: Tin; Length: 9.9mm; Max Operating Temperature: 85°C; Series: XH; Min Operating Temperature: -25°C; Fastening Type: Detent; Mount: Through Hole
J19 J20 = CMP-17439-000637-1: CONN HEADER VERT 8POS 2.5MM; Voltage Rating: 250V; Mated Stacking Heights: 9.8mm; Number of Positions: 8; Mount: Through Hole; Packaging: Bulk; Pitch: 2.5mm; Insulation Color: Natural; Lead Free: Lead Free; Termination: Press-Fit; Connector Type: Header; Contact Finish - Mating: TIN; Color: Green; Contact Type: Male Pin; Contact Material: Brass; Flammability Rating: UL94 V-0; Fastening Type: Detent; Contact Shape: Square; Series: XH; Insulation Material: Nylon; Number of Rows: 1; Contact Plating: Tin
MH1-MH14 = CMP-00028-00001-11: Plated mounting hole with 6 peripheral vias. This is a generic symbol that groups all relevant footprints.
Q1 Q2 = CMP-2000-05968-1: N-Channel Enhancement Mode Mosfet, 50 V, 200 mA, -55 to 150 degC, 6-Pin SOT-323, RoHS, Tape and Reel; Typical Turn-Off Delay Time: 20ns; Number of Channels: 1Channel; Type: EnhancementModeFieldEffectTransistor; Brand: DiodesIncorporated; Vds - Drain-Source Breakdown Voltage: 75V; Vgs - Gate-Source Voltage: 20V; Rds On - Drain-Source Resistance: 1.4Ohms; Transistor Type: 1N-Channel; Configuration: Single; Unit Weight: 0.000212oz; Pd - Power Dissipation: 200mW; Id - Continuous Drain Current: 200mA; Forward Transconductance - Min: 0.1S; Manufacturer URL: http://www.diodes.com/; Series: BSS138; Package Description: 3-Pin Small Outline Transistor, Body 2 x 1.25 mm, Pitch 0.65 mm; Mounting Technology: SurfaceMount; Product Category: MOSFET; RoHS: True; Maximum Operating Temperature: +150C; Height: 1mm; Length: 2.2mm; Technology: Si; Width: 1.35mm; Datasheet URL: http://www.diodes.com/_files/datasheets/ds30206.pdf; Manufacturer: DiodesIncorporated; Package / Case: SOT-323-3; Typical Turn-On Delay Time: 20ns; Transistor Polarity: N-Channel; Factory Pack Quantity: 3000; Packaging: Reel; Product: MOSFETSmallSignal; Datasheet Version: Rev. 11-2, 09/2013; Package Reference: SOT323; Minimum Operating Temperature: -55C; Mounting Style: SMD/SMT; Channel Mode: Enhancement
Q11 = CMP-019-00054-1: Power Switch ICs – Power Distribution; VISHAY; SIP32510DT-T1-GE3; 1; 1; 5.5 V; SOT-23-6; Max Supply Voltage: 5.5V; Max Power Dissipation: 833mW; Min Supply Voltage: 1.2V; Case/Package: SOT-23-6; Mounting Technology: Surface Mount; Max Operating Temperature: 85°C; Min Operating Temperature: -40°C
R1-R9 R23 R47 R62-R64 R132-R136 R140 = CMP-009-00002-14: Resistor
  R1 R2 R4 R5 R7 R64: Value: 100k
  R3 R6 R8 R9 R47 R63 R132 R133: Value: 1k
  R23 R140: Value: 27
  R62: Value: DNP
  R134-R136: Value: 0
R145 = CMP-009-00118-2: READ THE NAME; Pins: 2; Component Type: Standard; Design Item ID: CMP-009-00206-2; Source: 0402jump.SchLib